# Altium project Young.PrjPCB
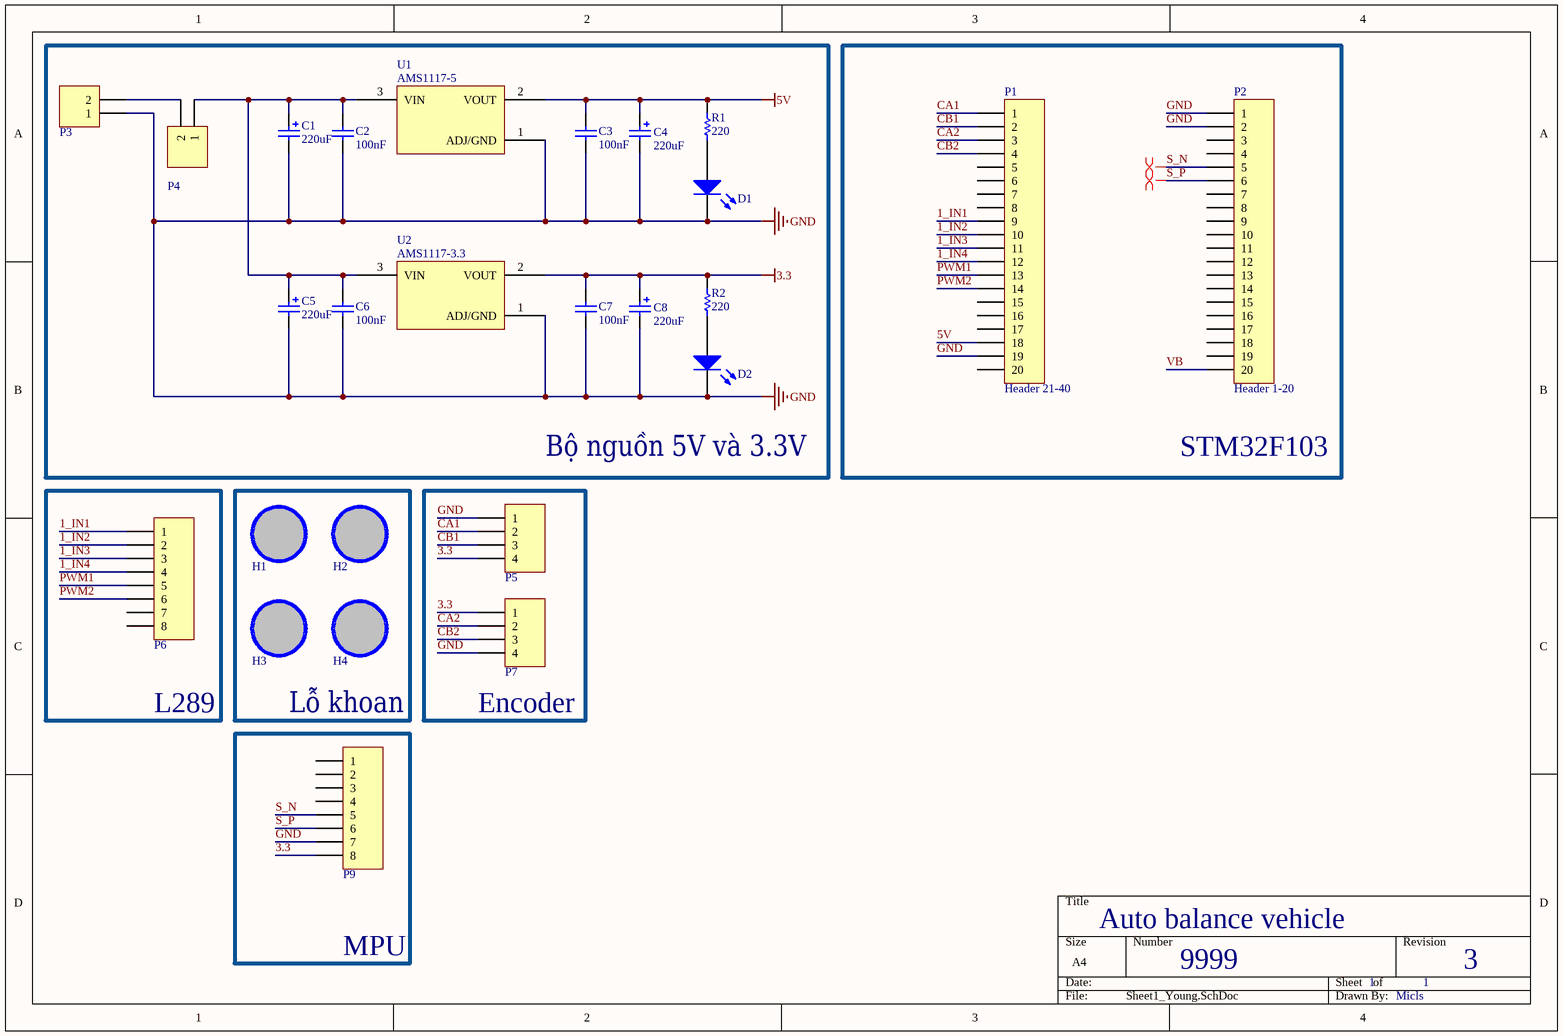
[diagram p0: Sheet1_Young.SchDoc]
1 sheet, 26 parts. Net scope: global (net labels, ports and power ports of the same name join across sheets).
Board file: PCB1_Young.PcbDoc

## Sheet Sheet1_Young.SchDoc: Auto balance vehicle
size A4; DrawnBy: Micls; DocumentNumber: 9999; Revision: 3; SheetNumber: 1; SheetTotal: 1

### Parts
C1  value 220uF  [CAP ALU SIZE B]  (hidden comment: Cap Pol SMD)
C2  value 100nF  [CAP-SM-0805]  (hidden comment: Cap Non-Pol SMD)
C3  value 100nF  [CAP-SM-0805]  (hidden comment: Cap Non-Pol SMD)
C4  value 220uF  [CAP ALU SIZE B]  (hidden comment: Cap Pol SMD)
C5  value 220uF  [CAP ALU SIZE B]  (hidden comment: Cap Pol SMD)
C6  value 100nF  [CAP-SM-0805]  (hidden comment: Cap Non-Pol SMD)
C7  value 100nF  [CAP-SM-0805]  (hidden comment: Cap Non-Pol SMD)
C8  value 220uF  [CAP ALU SIZE B]  (hidden comment: Cap Pol SMD)
D1  LED SMD  [LED_0805_Blue]  (value not drawn)
D2  LED SMD  [LED_0805_Blue]  (value not drawn)
H1  Hole  [LO KHOAN 3MM]  (value not drawn)
H2  Hole  [LO KHOAN 3MM]  (value not drawn)
H3  Hole  [LO KHOAN 3MM]  (value not drawn)
H4  Hole  [LO KHOAN 3MM]  (value not drawn)
P1  Header 21-40  [HDR1X20]
P2  Header 1-20  [HDR1X20]
P3  Domino 2  [DOMINO 2- 5mm]  (value not drawn)
P4  Domino 2  [DOMINO 2- 5mm]  (value not drawn)
P5  Header 4  [JP4]  (value not drawn)
P6  Header 8  [JP8]  (value not drawn)
P7  Header 4  [JP4]  (value not drawn)
P9  Header 8  [JP8]  (value not drawn)
R1  value 220  [RES-SM-0805]  (hidden comment: RESISTOR SMD)
R2  value 220  [RES-SM-0805]  (hidden comment: RESISTOR SMD)
U1  AMS1117-5  [SOT230P700X180-4N]
U2  AMS1117-3.3  [SOT230P700X180-4N]

### Blocks framed on the sheet
Bộ nguồn 5V và 3.3V: C1-C8 D1 D2 P3 P4 R1 R2 U1 U2
STM32F103: P1 P2
L289: P6
Lỗ khoan: H1-H4
Encoder: P5 P7
MPU: P9

### Nets
3.3: C7.1 C8.1 P5.4 P7.1 P9.8 R2.2 U2.2(VOUT)
5V: C3.1 C4.1 P1.18 R1.2 U1.2(VOUT)
GND: C1.2 C2.1 C3.2 C4.2 C5.2 C6.1 C7.2 C8.2 D1.2(K) D2.2(K) P1.19 P2.1 P2.2 P3.1 P5.1 P7.4 P9.7 U1.1(ADJ/GND) U2.1(ADJ/GND)
1_IN1: P1.9 P6.1
1_IN2: P1.10 P6.2
1_IN3: P1.11 P6.3
1_IN4: P1.12 P6.4
CA1: P1.1 P5.2
CA2: P1.3 P7.2
CB1: P1.2 P5.3
CB2: P1.4 P7.3
PWM1: P1.13 P6.5
PWM2: P1.14 P6.6
S_N: P2.5 P9.5
S_P: P2.6 P9.6
VB: P2.20
NetC1_1: C1.1 C2.2 C5.1 C6.2 P4.1 U1.3(VIN) U2.3(VIN)
NetD1_1: D1.1(A) R1.1
NetD2_1: D2.1(A) R2.1
NetP3_2: P3.2 P4.2

Not connected (* = marked no-connect by the designer): H1 1; H2 1; H3 1; H4 1; P1 5 6 7 8 15 16 17 20; P2 3 4 7 8 9 10 11 12 13 14 15 16 17 18 19; P6 7 8; P9 1 2 3 4

### Layout directives
differential pair: S_N, S_P

### Notes on the sheet
- 1

### Library data of the parts
C1 C4 C5 C8 = Cap Pol SMD: Polarized Capacitor (Radial)
C2 C3 C6 C7 = Cap Non-Pol SMD: Capacitor
D1 D2 = LED SMD: LED
H1-H4 = Hole: Hole 3mm
P1 P2 = Header 20: Header, 20-Pin; LatestRevisionDate: 17-Jul-2002; LatestRevisionNote: Re-released for DXP Platform.; Publisher: Altium Limited
P3 P4 = Domino 2: Domino, 2-Pin; LatestRevisionDate: 17-Jul-2002; LatestRevisionNote: Re-released for DXP Platform.; Publisher: Altium Limited
P5 P7 = Header 4: Header, 4-Pin; LatestRevisionDate: 17-Jul-2002; LatestRevisionNote: Re-released for DXP Platform.; Publisher: Altium Limited
P6 P9 = Header 8: Header, 8-Pin; LatestRevisionDate: 17-Jul-2002; LatestRevisionNote: Re-released for DXP Platform.; Publisher: Altium Limited
R1 R2 = RESISTOR SMD: Resistor
U1 U2 = AMS1117-3.3: MF: NEC; Price: None; SnapEDA_Link: https://www.snapeda.com/parts/AMS1117-3.3/NEC/view-part/?ref=snap; Availability: Unavailable; MP: AMS1117-3.3; Package: None; Value: *